# EAGLE board CHIP_POCKET_C (EAGLE 7.6.0)
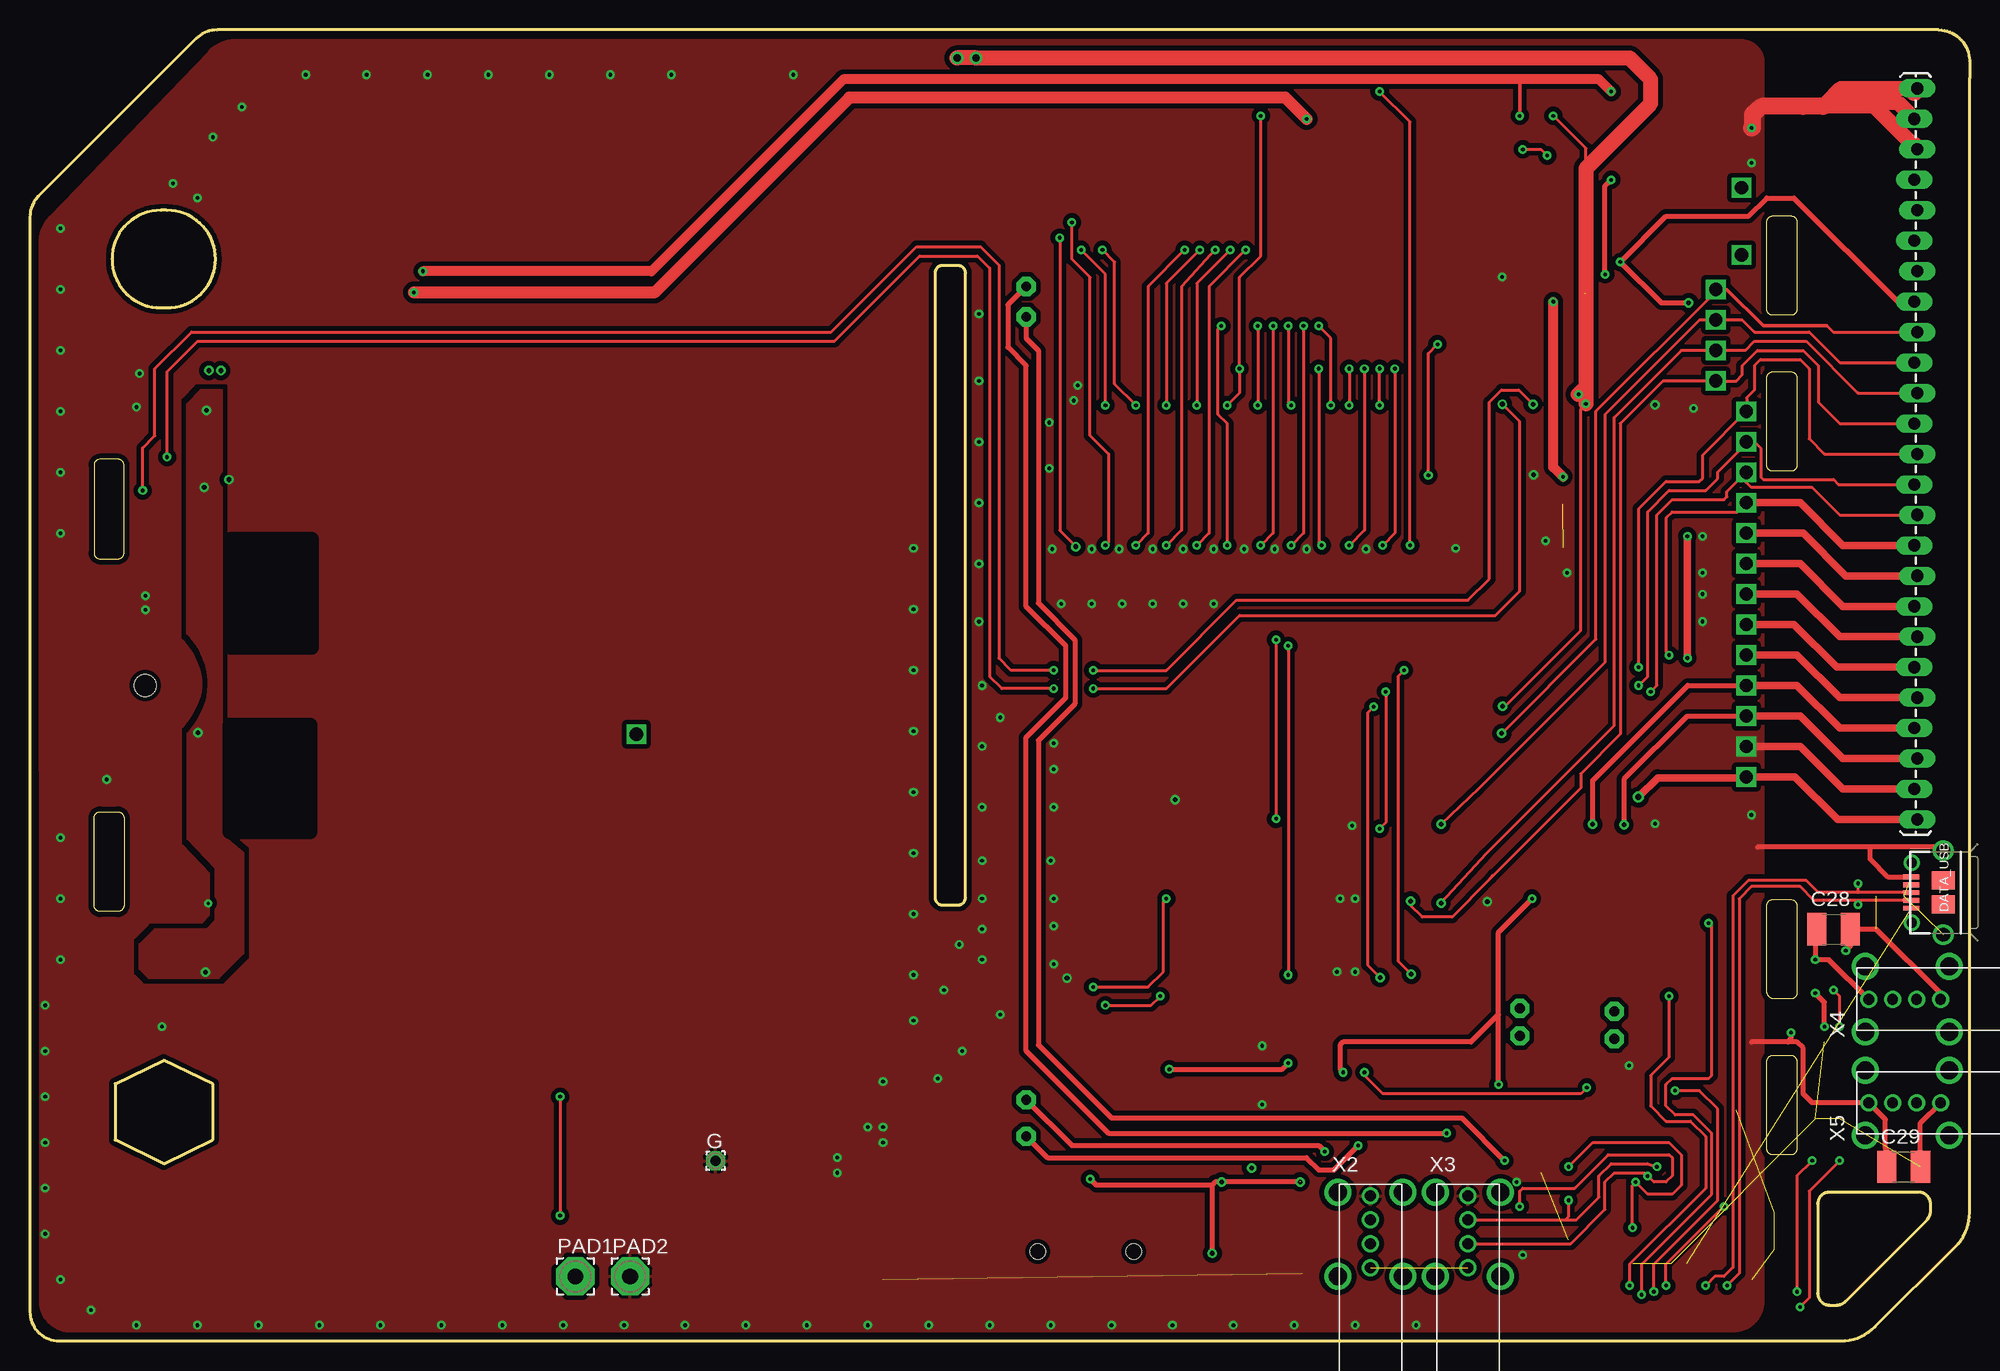
[diagram p2: board, top side]
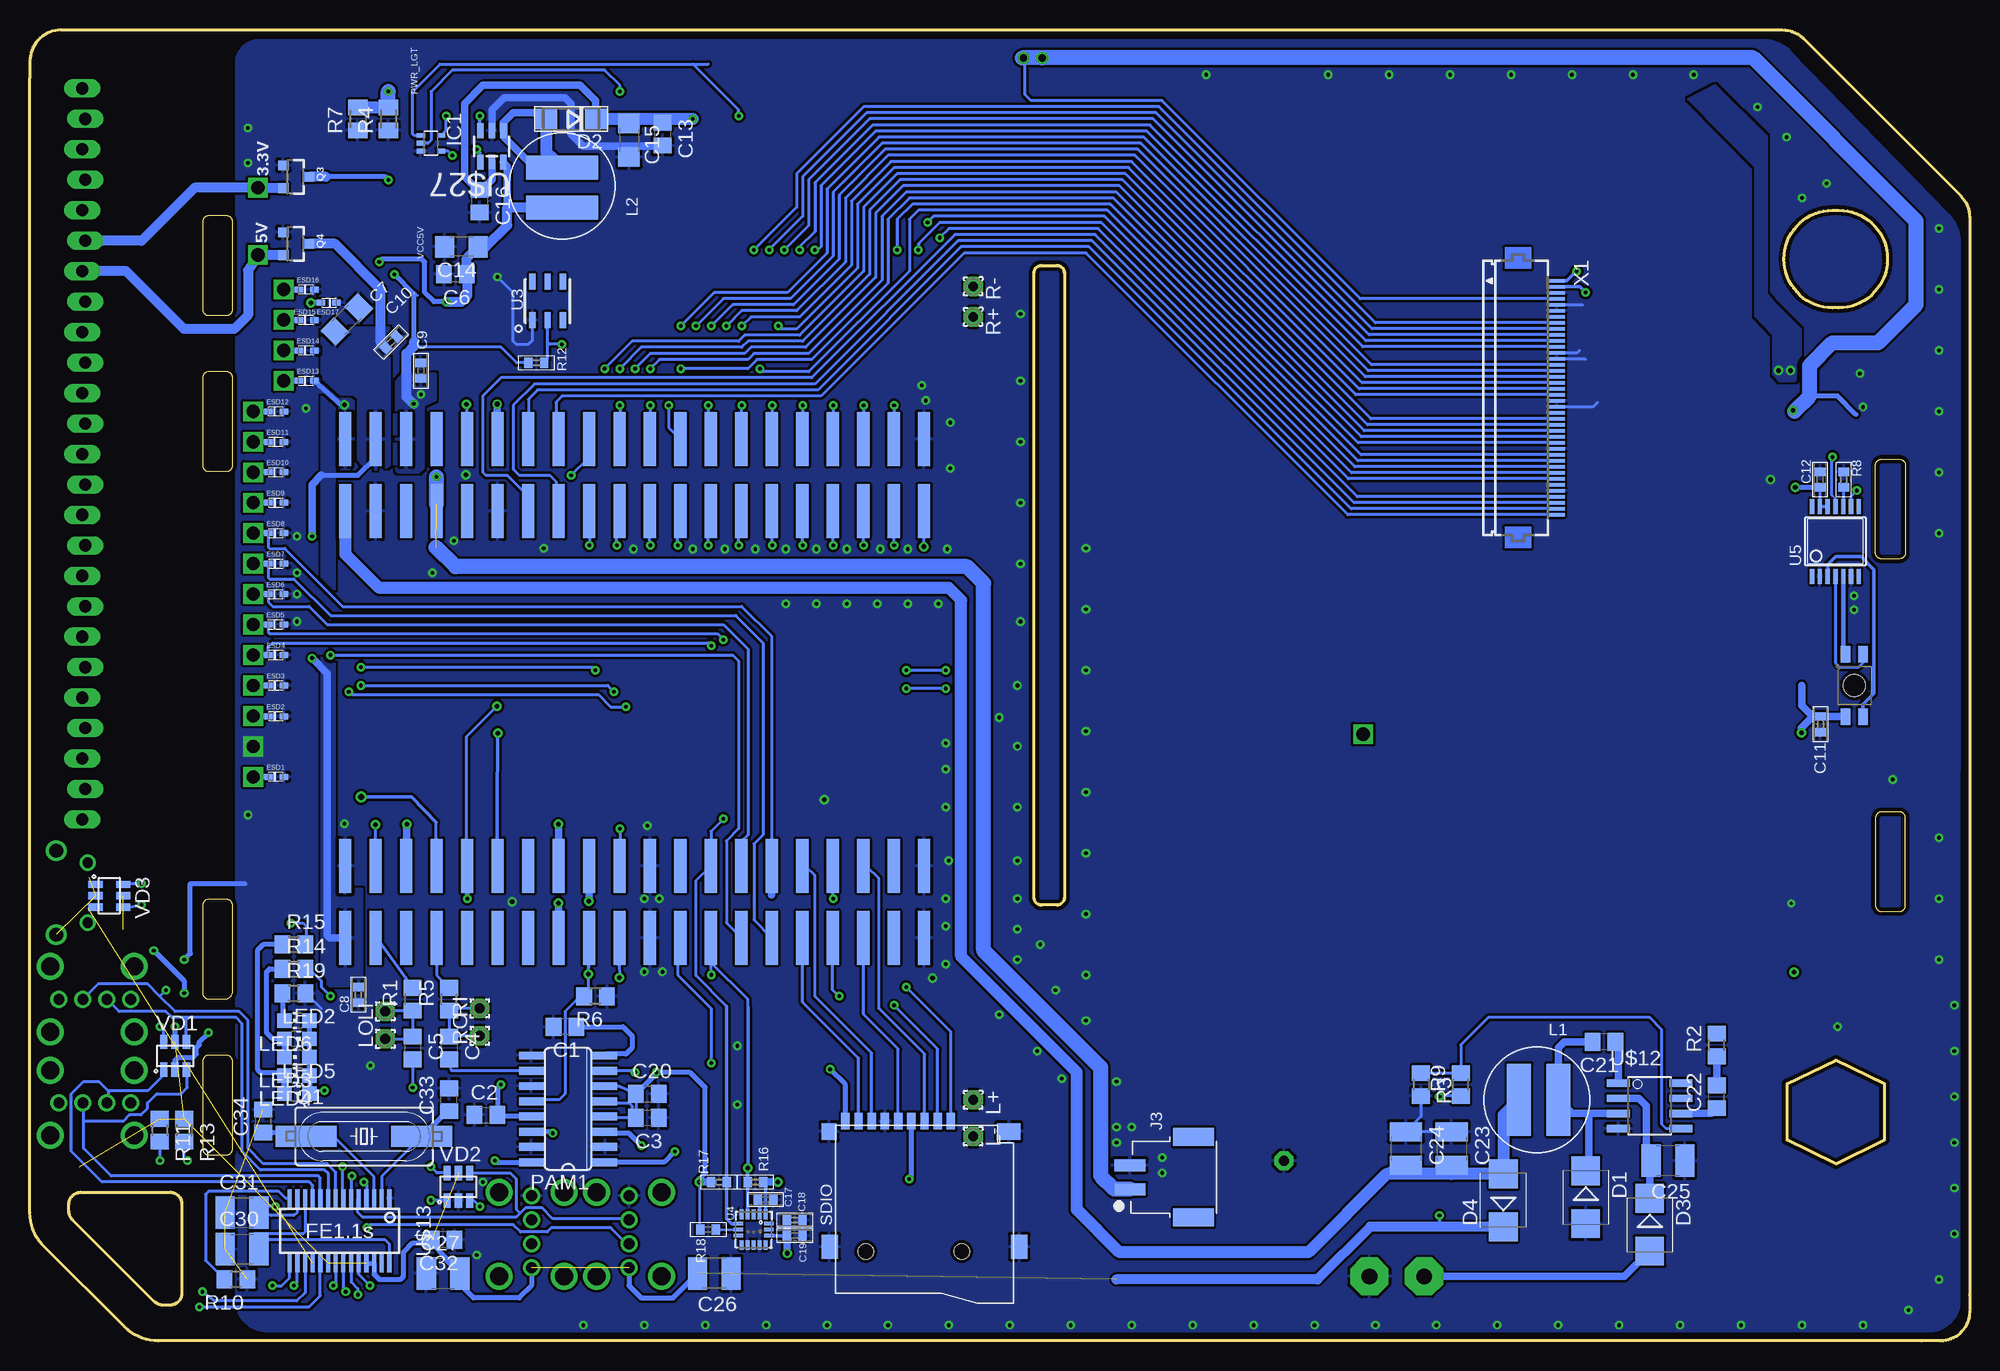
[diagram p3: board, bottom side, seen from below]

Size 161.7 x 109.31 mm. Coordinates in mm from the lower left corner, seen from the top.
Outline: 4,0 150.99,0 arc45 153.81,1.17 160.52,7.85 arc45 161.7,10.69 161.7,105.31
Outline: 0,3.85 0,93.72 arc-45 0.71,95.43 13.88,108.6 arc-45 15.59,109.31 159.13,109.31 arc-90 161.7,106.74 161.7,105.29
Outline: 0,3.84 0,2.42 arc90 2.42,0 4.02,0
Outline: 158.16,10.11 arc45 158.45,10.82 158.45,11.4 arc90 157.45,12.4 150.04,12.4 arc90 149.04,11.4 149.04,3.99 arc90 150.04,2.99 150.62,2.99 arc45 151.33,3.28 158.16,10.11
Outline: 11.41,86.15 arc90 15.48,90.21 arc90 11.41,94.27 10.9,94.27 arc90 6.84,90.21 arc90 10.9,86.15 11.41,86.15
Outline: 77.36,36.34 arc90 78,36.97 78,89.04 arc90 77.36,89.68 76.09,89.68 arc90 75.46,89.04 75.46,36.97 arc90 76.09,36.34 77.36,36.34
Outline: 7.09,21.44 7.09,16.75 11.16,14.78 15.22,16.75 15.22,21.44 11.16,23.41 7.09,21.44
Outline: 7.84,43.61 7.84,36.31 arc-90 7.34,35.81 5.84,35.81 arc-90 5.34,36.31 5.34,43.61 arc-90 5.84,44.11 7.34,44.11 arc-90 7.84,43.61
Outline: 5.34,73.01 5.34,65.71 arc90 5.84,65.21 7.34,65.21 arc90 7.84,65.71 7.84,73.01 arc90 7.34,73.51 5.84,73.51 arc90 5.34,73.01
Outline: 146.81,85.51 145.31,85.51 arc-90 144.81,86.01 144.81,93.31 arc-90 145.31,93.81 146.81,93.81 arc-90 147.31,93.31 147.31,86.01 arc-90 146.81,85.51
Outline: 146.81,72.51 145.31,72.51 arc-90 144.81,73.01 144.81,80.31 arc-90 145.31,80.81 146.81,80.81 arc-90 147.31,80.31 147.31,73.01 arc-90 146.81,72.51
Outline: 146.81,28.51 145.45,28.51 arc-90 144.81,29.15 144.81,36.31 arc-90 145.31,36.81 146.81,36.81 arc-90 147.31,36.31 147.31,29.01 arc-90 146.81,28.51
Outline: 146.81,15.51 145.31,15.51 arc-90 144.81,16.01 144.81,23.31 arc-90 145.31,23.81 146.81,23.81 arc-90 147.31,23.31 147.31,16.01 arc-90 146.81,15.51
Copper layers (1*2*15*16): Top 0.035mm / dielectric 0.2mm / Route2 0.035mm / dielectric 0.2mm / Route15 0.035mm / dielectric 0.2mm / Bottom 0.035mm
Design rules "Hampoo *": minimum track width 3mil, minimum drill 8mil, track to track 3mil, track to pad 3mil, pad to pad 3mil, via to via 3mil, smd to smd 3mil, copper to edge 12mil, drill to drill 8mil, minimum pad ring 10mil, minimum via ring 8mil, stop-mask expansion 4mil, vias tented up to drill 24mil, thermal gap 10mil
tRestrict: area 16.8,57.8 to 23.5,66.8; area 16.6,42.5 to 23.4,51.3

## Footprints (pad centres in the part's own frame; a part is rotated, then mirrored left to right if it is on the bottom)
C0805 = smd 1.3 x 1.5: 1 -0.95,0; 2 0.95,0
C1206 = smd 1.6 x 1.8: 1 -1.4,0; 2 1.4,0
C0402 = smd 0.7 x 0.9: 1 -0.65,0; 2 0.65,0
C1210 = smd 1.6 x 2.7: 1 -1.4,0; 2 1.4,0
SMB = smd 2.4 x 2.4: A 2.2,0; C -2.2,0
DO-214AC = smd 1.8 x 1.7: A 2.05,0; C -2.05,0
USB-MICROB-SMT-DIP = smd 0.4 x 1.35: D+ 0,2.675; D- -0.65,2.675; GND 1.3,2.675; ID 0.65,2.675; VBUS -1.3,2.675 | drill 1.15 pad 1.7: MT1 -3.5,0; MT2 3.5,0 | drill 0.85 pad 1.25: MT3 -2.5,2.625; MT4 2.5,2.625 | smd 1.5 x 1.9: P$1 -1,0; P$2 1,0.01
SOD523 = smd 0.7 x 0.5: A 0.7,0; C -0.6,0
1,6/0,8 = drill 0.813 pad 1.6 octagon: 1 0,0
SC70-5 = smd 0.4 x 0.7: 1 -0.65,-0.85; 2 0,-0.85; 3 0.65,-0.85; 4 0.65,0.85; 5 -0.65,0.85
2XAWHW40_G_SMD_R = smd 4.5 x 1.02 bottom: AP-EINT1 35.1,21.59; AP-EINT3 41.1,21.59; BAT 5.54,41.91; CHG-IN 5.54,49.53; CISD4 35.1,6.35; CSICK 41.1,16.51; CSID0 35.1,11.43; CSID1 41.1,11.43; CSID2 35.1,8.89; CSID3 41.1,8.89; CSID5 41.1,6.35; CSID6 35.1,3.81; CSID7 41.1,3.81; CSIHYSYNC 35.1,13.97; CSIVSYNC 41.1,13.97; CSPICK 35.1,16.51; FEL 35.1,41.91; GND@1 -0.46,49.53; GND@2 5.54,46.99; GND@3 5.54,36.83; GND@4 -0.46,1.27; GND@5 41.1,1.27; GND@6 35.1,1.27; GND@7 41.1,24.13; GND@8 35.1,24.13; GND@10 35.1,49.53; HPCOM 41.1,44.45; HPL 41.1,46.99; HPR 41.1,41.91; LCD-CLK -0.46,6.35; LCD-D2 -0.46,29.21; LCD-D3 5.54,26.67; LCD-D4 -0.46,26.67; LCD-D5 5.54,24.13; LCD-D6 -0.46,24.13; LCD-D7 5.54,21.59; LCD-D10 -0.46,21.59; LCD-D11 5.54,19.05; LCD-D12 -0.46,19.05; LCD-D13 5.54,16.51; LCD-D14 -0.46,16.51; LCD-D15 5.54,13.97; LCD-D18 -0.46,13.97; LCD-D19 5.54,11.43; LCD-D20 -0.46,11.43; LCD-D21 5.54,8.89; LCD-D22 -0.46,8.89; LCD-D23 5.54,6.35; LCD-DE 5.54,1.27; LCD-HSYNC 5.54,3.81; LCD-VSYNC -0.46,3.81; LRADC 35.1,36.83; MICIN1 41.1,36.83; MICM 41.1,39.37; PWM0 5.54,29.21; PWRON 5.54,39.37; TS 5.54,44.45; TWI1-SCK -0.46,36.83; TWI1-SDA -0.46,39.37; TWI2-SCK 41.1,19.05; TWI2-SDA 35.1,19.05; UART1-RX 35.1,44.45; UART1-TX 35.1,46.99; VCC1V8 -0.46,41.91; VCC3V3@1 35.1,39.37; VCC3V3@2 -0.46,44.45; VCC-5V@1 -0.46,46.99; VCC-5V@2 41.1,49.53; X1 -0.46,34.29; X2 5.54,34.29; XIO-P0 35.1,34.29; XIO-P1 41.1,34.29; XIO-P2 35.1,31.75; XIO-P3 41.1,31.75; XIO-P4 35.1,29.21; XIO-P5 41.1,29.21; XIO-P6 35.1,26.67; XIO-P7 41.1,26.67; Y1 -0.46,31.75; Y2 5.54,31.75
S2B-PH-SM4-TB = smd 2.6 x 1: 1 0,-1; 2 0,1 | smd 3.4 x 1.5: MNT1 5.3,3.35; MNT2 5.3,-3.35
1X20_LOCK_LONGPADS = drill 1.016 long: 1 0,0.127; 2 2.54,-0.127; 3 5.08,0.127; 4 7.62,-0.127; 5 10.16,0.127; 6 12.7,-0.127; 7 15.24,0.127; 8 17.78,-0.127; 9 20.32,0.127; 10 22.86,-0.127; 11 25.4,0.127; 12 27.94,-0.127; 13 30.48,0.127; 14 33.02,-0.127; 15 35.56,0.127; 16 38.1,-0.127; 17 40.64,0.127; 18 43.18,-0.127; 19 45.72,0.127; 20 48.26,-0.127; 21 50.8,0.127; 22 -2.54,-0.127; 23 -5.08,0.127; 24 -7.62,-0.127; 25 -10.16,0.127
SRN6045 = smd 2 x 6: P$1 1.5,0; P$2 -1.8,0
XZMDKCBDDG45S-9 = smd 1.4 x 0.8: BLUE -2.6,-0.725; GREEN 2.6,-0.725; RED 2.6,0.725; VIN -2.6,0.725 | hole 1.8: 0,0
CHIP-LED0805 = smd 1.2 x 1.2: A 0,-1.05; C 0,1.05
3,17/1,3 = drill 1.321 pad 3.175 octagon: 1 0,0
SOP-16 = smd 0.66 x 2.032: 1 -4.445,-3.073; 2 -3.175,-3.073; 3 -1.905,-3.073; 4 -0.635,-3.073; 5 0.635,-3.073; 6 1.905,-3.073; 7 3.175,-3.073; 8 4.445,-3.073; 9 4.445,3.073; 10 3.175,3.073; 11 1.905,3.073; 12 0.635,3.073; 13 -0.635,3.073; 14 -1.905,3.073; 15 -3.175,3.073; 16 -4.445,3.073
SM49 = smd 5.08 x 1.778: 1 -4.826,0; 2 4.826,0
SOT23-3 = smd 0.8 x 0.9: 1 -0.95,-1; 2 0.95,-1; 3 0,1.1
R0805 = smd 1.3 x 1.5: 1 -0.95,0; 2 0.95,0
M0805 = smd 1.3 x 1.6: 1 -0.95,0; 2 0.95,0
R0402 = smd 0.7 x 0.9: 1 -0.65,0; 2 0.65,0
TF-PULL = smd 0.7 x 1.4: 1 -2.2,-7.62; 2 -1.1,-7.62; 3 0,-7.62; 4 1.1,-7.62; 5 2.2,-7.62; 6 3.3,-7.62; 7 4.4,-7.62; 8 5.5,-7.62; 9 6.6,-7.62 | smd 1.4 x 2: S1 -7.9,2.85; S2 7.9,2.85 | smd 1.28 x 1.4: S3 7.96,-6.75 | smd 1.95 x 1.4: S4 -7.025,-6.75 | hole 1.25: -3.1,3.25; 4.9,3.25
TSOC6 = smd 0.53 x 1.33: 1 -1.27,-1.6; 2 0,-1.6; 3 1.27,-1.6; 4 1.27,1.6; 5 0,1.6; 6 -1.27,1.6
QFN-16_0.5MM = smd 0.8 x 0.3: 1 -1.275,1; 2 -1.275,0.5; 3 -1.275,0; 4 -1.275,-0.5; 5 -1.275,-1; 9 1.275,-1; 10 1.275,-0.5; 11 1.275,0; 12 1.275,0.5; 13 1.275,1 | smd 0.3 x 0.8: 6 -0.5,-1.275; 7 0,-1.275; 8 0.5,-1.275; 14 0.5,1.275; 15 0,1.275; 16 -0.5,1.275
TSSOP14 = smd 0.36 x 1.26: 1 -1.95,-2.918; 2 -1.3,-2.918; 3 -0.65,-2.918; 4 0,-2.918; 5 0.65,-2.918; 6 1.3,-2.918; 7 1.95,-2.918; 8 1.95,2.918; 9 1.3,2.918; 10 0.65,2.918; 11 0,2.918; 12 -0.65,2.918; 13 -1.3,2.918; 14 -1.95,2.918
SOP-8 = smd 1.905 x 0.61: 1 -2.616,1.905; 2 -2.616,0.635; 3 -2.616,-0.635; 4 -2.616,-1.905; 5 2.616,-1.905; 6 2.616,-0.635; 7 2.616,0.635; 8 2.616,1.905
FE1.1S_SSOP-28 = smd 0.35 x 1.5: 1 -4.16,-2.7; 2 -3.52,-2.7; 3 -2.88,-2.7; 4 -2.24,-2.7; 5 -1.6,-2.7; 6 -0.96,-2.7; 7 -0.32,-2.7; 8 0.32,-2.7; 9 0.96,-2.7; 10 1.6,-2.7; 11 2.24,-2.7; 12 2.88,-2.7; 13 3.52,-2.7; 14 4.16,-2.7; 15 4.16,2.7; 16 3.52,2.7; 17 2.88,2.7; 18 2.24,2.7; 19 1.6,2.7; 20 0.96,2.7; 21 0.32,2.7; 22 -0.3,2.7; 23 -0.96,2.7; 24 -1.6,2.7; 25 -2.24,2.7; 26 -2.88,2.7; 27 -3.52,2.7; 28 -4.16,2.7
SOT23-6 = smd 0.559 x 1.219: 1 -0.95,-1.3; 2 0,-1.3; 3 0.965,-1.3; 4 0.965,1.321; 5 0,1.3; 6 -0.95,1.321
SOT-23-6L = smd 0.6 x 1.2: 1 -0.95,-2.3; 2 0,-2.3; 3 0.95,-2.3; 4 0.95,0; 5 0,0; 6 -0.95,0
FH12-40S-0.5SH = smd 0.3 x 1.3: 1 -9.75,3.25; 2 -9.25,3.25; 3 -8.75,3.25; 4 -8.25,3.25; 5 -7.75,3.25; 6 -7.25,3.25; 7 -6.75,3.25; 8 -6.25,3.25; 9 -5.75,3.25; 10 -5.25,3.25; 11 -4.75,3.25; 12 -4.25,3.25; 13 -3.75,3.25; 14 -3.25,3.25; 15 -2.75,3.25; 16 -2.25,3.25; 17 -1.75,3.25; 18 -1.25,3.25; 19 -0.75,3.25; 20 -0.25,3.25; 21 0.25,3.25; 22 0.75,3.25; 23 1.25,3.25; 24 1.75,3.25; 25 2.25,3.25; 26 2.75,3.25; 27 3.25,3.25; 28 3.75,3.25; 29 4.25,3.25; 30 4.75,3.25; 31 5.25,3.25; 32 5.75,3.25; 33 6.25,3.25; 34 6.75,3.25; 35 7.25,3.25; 36 7.75,3.25; 37 8.25,3.25; 38 8.75,3.25; 39 9.25,3.25; 40 9.75,3.25
USB-A-HU = drill 0.9: D+ 4.73,0; D- 2.73,0; GND 6.73,0; VBUS 0.73,0 | drill 1.5: P$5 0,2.72; P$6 0,-2.72; P$7 7,2.72; P$8 7,-2.72

## Placement (x,y rotation side)
C1  100nF  [C0805]  117.09,26.2 180 bottom
C2  1uF  [C0805]  123.7,18.84 0 bottom
C3  1uF  [C0805]  110.24,18.58 180 bottom
C4  470nF  [C0805]  126.75,24.42 270 bottom
C5  470nF  [C0805]  129.79,24.42 270 bottom
C6  100nF  [C0805]  126.24,88.94 180 bottom
C7  22uF  [C1206]  135.29,85.17 45 bottom
C8  100nF  [C0402]  134.31,28.86 270 bottom
C9  100nF  [C0402]  129.12,80.89 90 bottom
C10  100nF  [C0402]  131.58,83.28 45 bottom
C11  1uF  [C0402]  12.42,51.41 90 bottom
C12  1uF  [C0402]  12.45,71.82 270 bottom
C13  100nF  [C0805]  108.97,100.62 270 bottom
C14  22uF  [C1206]  125.73,91.23 180 bottom
C15  22uF  [C1206]  111.76,100.12 270 bottom
C16  10nF  [C0805]  124.21,95.04 270 bottom
C17  100nF  [C0402]  100.38,11.78 0 bottom
C18  4.7uF  [C0402]  97.94,10.07 0 bottom
C19  100nF  [C0402]  97.94,8.78 0 bottom
C20  1uF  [C0805]  110.24,20.61 0 bottom
C21  10nF/50V  [C0805]  30.48,24.93 180 bottom
C22  2.2nF  [C0805]  21.08,20.36 90 bottom
C23  VJ1210V106ZXJTW1BC  [C1210]  43.18,16.04 270 bottom
C24  VJ1210V106ZXJTW1BC  [C1210]  46.99,16.04 270 bottom
C25  10uF/25V  [C1210]  25.15,15.03 180 bottom
C26  n.a.  [C1210]  104.65,5.63 180 bottom
C27  n.a.  [C1210]  127.25,5.63 0 bottom
C28  n.a.  [C1210]  150.37,34.33 0 top
C29  n.a.  [C1210]  156.21,14.52 0 top
C30  VJ1210V106ZXJTW1BC  [C1210]  144.02,7.66 0 bottom
C31  VJ1210V106ZXJTW1BC  [C1210]  144.02,10.71 0 bottom
C32  100nF  [C0805]  127.25,8.42 180 bottom
C33  22pF  [C0805]  126.75,20.11 90 bottom
C34  22pF  [C0805]  142.24,18.33 90 bottom
D1  ES2D  [SMB]  32,11.98 270 bottom
D2  B240A  [DO-214AC]  116.59,101.89 180 bottom
D3  ES2D  [SMB]  26.67,9.69 270 bottom
D4  ES2D  [SMB]  38.86,11.72 90 bottom
DATA_USB  USBUSB-MICROB-SMT-DIP  [USB-MICROB-SMT-DIP]  159.51,37.38 90 top
ESD1  ESD5Z2.5T1G  [SOD523]  141.22,47.03 0 bottom
ESD2  ESD5Z2.5T1G  [SOD523]  141.22,52.08 0 bottom
ESD3  ESD5Z2.5T1G  [SOD523]  141.22,54.65 0 bottom
ESD4  ESD5Z2.5T1G  [SOD523]  141.22,57.2 0 bottom
ESD5  ESD5Z2.5T1G  [SOD523]  141.23,59.74 0 bottom
ESD6  ESD5Z2.5T1G  [SOD523]  141.23,62.27 0 bottom
ESD7  ESD5Z2.5T1G  [SOD523]  141.22,64.81 0 bottom
ESD8  ESD5Z2.5T1G  [SOD523]  141.22,67.35 0 bottom
ESD9  ESD5Z2.5T1G  [SOD523]  141.22,69.89 0 bottom
ESD10  ESD5Z2.5T1G  [SOD523]  141.23,72.44 0 bottom
ESD11  ESD5Z2.5T1G  [SOD523]  141.23,74.96 0 bottom
ESD12  ESD5Z2.5T1G  [SOD523]  141.23,77.51 0 bottom
ESD13  ESD5Z2.5T1G  [SOD523]  138.69,80.05 0 bottom
ESD14  ESD5Z2.5T1G  [SOD523]  138.69,82.58 0 bottom
ESD15  ESD5Z2.5T1G  [SOD523]  138.69,85.12 0 bottom
ESD16  ESD5Z2.5T1G  [SOD523]  138.69,87.67 0 bottom
ESD17  ESD5Z2.5T1G  [SOD523]  136.76,86.57 180 bottom
G  [1,6/0,8]  57.15,15.03 0 top
IC1  74AHC1G08DCK  [SC70-5]  128.27,99.86 270 bottom
J1  2X20-CHIP2X20-SMT-CHIP  [2XAWHW40_G_SMD_R]  85.88,74.72 270 top
J3  S2B-PH-SM4-TB  [S2B-PH-SM4-TB]  70,13.65 0 bottom
JP1  NC  [1X20_LOCK_LONGPADS]  157.21,94.27 270 top
L1  SRN6045-100M  [SRN6045]  36.07,20.11 180 bottom
L2  SRN6045-100M  [SRN6045]  117.35,96.31 90 bottom
L+  [1,6/0,8]  83.06,20.11 270 bottom
L-  [1,6/0,8]  83.06,17.06 270 bottom
LED1  XZMDKCBDDG45S-9  [XZMDKCBDDG45S-9]  9.6,54.65 90 bottom
LED2  150080BS75000  [CHIP-LED0805]  139.45,25.19 270 bottom
LED3  150080BS75000  [CHIP-LED0805]  139.45,23.66 90 bottom
LED4  150080BS75000  [CHIP-LED0805]  139.45,22.14 90 bottom
LED5  150080BS75000  [CHIP-LED0805]  139.45,20.61 270 bottom
LED6  150080BS75000  [CHIP-LED0805]  139.45,26.71 90 bottom
LI  [1,6/0,8]  132.08,27.47 90 bottom
LO  [1,6/0,8]  132.08,25.19 90 bottom
PAD1  WIREPAD3,17/1,3  [3,17/1,3]  45.47,5.37 0 top
PAD2  WIREPAD3,17/1,3  [3,17/1,3]  50.04,5.37 0 top
PAM1  [SOP-16]  116.84,19.34 90 bottom
Q1  FOXSDLF/120-20  [SM49]  133.86,17.06 0 bottom
Q3  MOSFET-PCHANNEL  [SOT23-3]  139.57,97.07 270 bottom
Q4  MOSFET-PCHANNEL  [SOT23-3]  139.57,91.48 270 bottom
R1  10k  [R0805]  129.79,28.49 90 bottom
R2  15k  [R0805]  21.08,24.68 90 bottom
R3  10k  [R0805]  45.72,21.38 270 bottom
R4  10 / n.a.  [M0805]  131.83,101.89 90 bottom
R5  10k  [R0805]  126.75,28.49 90 bottom
R6  12k  [R0805]  114.55,28.74 180 bottom
R7  10 / n.a.  [M0805]  134.37,101.89 90 bottom
R8  62K  [R0402]  10.49,71.82 270 bottom
R9  28.7k  [R0805]  42.42,21.38 90 bottom
R10  2.7k  [R0805]  144.53,5.12 180 bottom
R11  10k  [R0805]  150.88,17.57 270 bottom
R12  4.7K  [R0402]  119.49,81.56 180 bottom
R13  10k  [R0805]  148.84,17.57 270 bottom
R14  ERJ-6ENF3300V  [R0805]  139.7,31.03 0 bottom
R15  ERJ-6ENF3300V  [R0805]  139.7,33.06 0 bottom
R16  4.7K  [R0402]  101.22,13.25 0 bottom
R17  4.7K  [R0402]  104.27,13.25 180 bottom
R18  4.7K  [R0402]  105.16,9.29 180 bottom
R19  ERJ-6ENF3300V  [R0805]  139.7,29 0 bottom
R+  [1,6/0,8]  83.06,85.38 270 bottom
R-  [1,6/0,8]  83.06,87.92 270 bottom
RI  [1,6/0,8]  124.21,27.73 90 bottom
RO  [1,6/0,8]  124.21,25.44 90 bottom
SDIO  TF-HOLDER  [TF-PULL]  87.12,10.71 180 bottom
U3  DS2431P  [TSOC6]  118.55,86.71 0 bottom
U4  MMA8452Q  [QFN-16_0.5MM]  101.37,9.29 270 bottom
U5  NCP5623DTBR2G  [TSSOP14]  11.18,66.66 0 bottom
U$12  ACT4060ASHDEFAULT  [SOP-8]  26.67,19.6 0 bottom
U$13  FE1.1S  [FE1.1S_SSOP-28]  135.89,9.18 180 bottom
U$27  AP3032 / n.a.  [SOT23-6]  123.19,99.61 180 bottom
VD1  n.a.  [SOT-23-6L]  149.61,24.93 0 bottom
VD2  n.a.  [SOT-23-6L]  125.98,14.01 0 bottom
VD3  n.a.  [SOT-23-6L]  153.92,37.12 270 bottom
X1  FH12-40S-0.5SH  [FH12-40S-0.5SH]  37.64,78.64 270 bottom
X2  USB-A-HU  [USB-A-HU]  111.76,5.37 90 top
X3  USB-A-HU  [USB-A-HU]  119.89,5.37 90 top
X4  USB-A-HU  [USB-A-HU]  160.02,28.49 180 top
X5  USB-A-HU  [USB-A-HU]  160.02,19.85 180 top

## Tracks (layer width: path | path; a pad name or v marks a point on that pad's centre or on a via)
1WIRE  (via drill 0.3)
  Top 0.254: v116.59,72.18 116.59,82.34 v117.35,83.1
  Bottom 0.254: J1.LCD-D2 115.14,75.22 115.14,73.62 v116.59,72.18 | v117.35,83.1 118.36,83.1 118.55,83.28 | 118.55,83.28 118.55,83.61 U3.2 | R12.1 118.55,81.85 118.55,83.28
3V3_SAFE  (via drill 1.1)
  Bottom 0.813: Q3.2 142.67,96.12 v142.7,96.15 147.98,96.15 152.4,91.73 155.7,91.73 156.21,91.73 JP1.2
5V_SAFE  (via drill 1.1)
  Bottom 0.61: 142.66,90.51 v142.7,90.55
  Bottom 0.813: Q4.2 142.68,90.53 v142.7,90.55 | 142.66,90.51 143.51,89.27 143.51,85.54 144.68,84.37 148.84,84.37 153.67,89.19 JP1.3
ADC  (via drill 0.38, 1.1)
  Top 0.254: v122.7,50.66 130.56,58.52 130.56,77.51 140.56,87.51 v140.56,87.67 | 149.8,84.65 150.34,84.11 JP1.5
  Top 0.305: 149.8,84.65 144.5,84.65 141.48,87.67 v140.56,87.67
  Bottom 0.305: 122.76,43.61 122.75,44.24 | 122.75,44.24 v122.7,50.66 | J1.LRADC 122.75,39.66 122.75,44.24
  Bottom 0.406: ESD16.C 139.23,87.67 v140.56,87.67
AUDIO_L
  Bottom 0.254: R1.2 132.59,33.33 J1.HPL
AUDIO_R
  Bottom 0.254: J1.HPR 127.79,30.49 R5.2
CHR
  Bottom 0.61: 46.99,14.52 48.01,14.52 48.77,13.76
  Bottom 0.813: C23.2 43.18,13.92 | C24.2 46.99,14.52
  Bottom 1.016: L1.P$1 38.86,18.81 D4.A 43.18,13.92 48.6,13.92 48.77,13.76 55.12,7.41 70.87,7.41 74.42,10.96 74.42,22.39 84.07,32.04 84.07,61.76 85.09,62.78 132.59,62.78 135.38,65.57 135.38,69.14 J1.CHG-IN
DCLK  (via drill 0.3)
  Top 0.254: v92.2,78.02 90.42,79.8 90.42,89.96 v89.41,90.97
  Bottom 0.254: X1.30 50.74,73.89 71.63,94.78 88.14,94.78 89.41,93.51 v89.41,90.97 | v92.2,78.02 92.2,75.21 J1.LCD-CLK
DISPL_GND  (via drill 0.3)
  Top 0.305: v124.21,102.15 124.21,105.2
  Top 0.813: v131.83,104.18 130.81,105.2 124.21,105.2 67.82,105.2 51.82,89.19 v32.77,89.19
  Bottom 0.305: v32.77,89.19 33.57,88.39 X1.1 | U$27.3 124.21,100.96 v124.21,102.15
  Bottom 1.016: R4.2 R7.2
  Bottom 1.27: R4.2 v131.83,104.18
DM1
  Bottom 0.254: U$13.10 137.49,13.58 137.67,13.76 154.94,13.76 157.23,16.04 157.23,18.33 | 157.23,18.33 157.23,19.79 X5.D- | 157.23,18.33 153.92,18.33 153.42,18.84 152.45,18.84 151.89,19.4 151.89,19.85 151.13,20.61 149.1,20.61 148.59,21.12 148.59,22.57 VD1.3
DM2  (via drill 0.3)
  Top 0.254: v150.88,26.2 150.88,28.74 v150.37,29.25
  Bottom 0.254: U$13.8 136.21,14.08 136.91,14.77 142.24,14.77 143.51,16.04 143.51,26.71 144.27,27.47 149.61,27.47 150.88,28.74 | 150.88,28.74 151.89,29.76 156.02,29.76 X4.D- | VD1.6 150.56,25.88 v150.88,26.2 | v150.37,29.25 150.88,28.74
DM3  (via drill 0.3)
  Top 0.254: X3.D- 128.46,8.1 131.32,10.96 131.32,13.25 132.08,14.01 134.62,14.01 v134.87,13.76 135.38,13.25 136.4,13.25 136.91,13.76 136.91,15.28 136.65,15.53 131.57,15.53 128.78,12.74 124.46,12.74 124.21,12.49 v124.21,11.22
  Bottom 0.254: v134.87,13.76 134.93,13.7 U$13.6 | VD2.3 124.7,11.71 v124.21,11.22
DM4  (via drill 0.3)
  Top 0.254: v133.6,9.44 133.6,12.99 v133.86,13.25 134.87,12.23 136.91,12.23 137.67,12.99 137.67,15.53 136.65,16.55 130.3,16.55 v128.27,14.52
  Bottom 0.254: X2.D- 111.95,8.1 113.28,9.44 118.24,9.44 118.59,9.09 120.81,9.09 121.41,9.69 133.35,9.69 v133.6,9.44 | v133.86,13.25 133.65,13.04 U$13.4 | VD2.6 127.76,14.01 v128.27,14.52
DMU  (via drill 0.3)
  Top 0.254: DATA_USB.D- 152.4,36.73 | 152.4,36.73 148.73,36.73 147.57,37.89 143.51,37.89 142.49,36.87 142.49,5.63 v141.48,4.61 | v152.4,36.36 152.4,36.73
  Bottom 0.254: v141.48,4.61 140.72,4.61 140.05,5.28 U$13.15 | VD3.4 153.86,36.11 v152.4,36.36
DP1
  Bottom 0.254: U$13.11 138.13,12.95 138.43,13.25 155.7,13.25 158.24,15.79 158.24,20.61 157.23,21.63 155.96,21.63 155.19,20.87 | 155.19,20.87 155.19,19.95 X5.D+ | VD1.1 150.56,22.2 151.89,20.87 155.19,20.87
DP2
  Bottom 0.254: U$13.9 136.85,13.95 137.16,14.26 142.49,14.26 144.02,15.79 144.02,26.46 144.53,26.96 148.59,26.96 | 148.59,26.96 149.86,26.96 150.37,27.47 154.27,27.47 X4.D+ | VD1.4 148.66,26.9 148.59,26.96
DP3  (via drill 0.3)
  Top 0.254: X3.D+ 128.02,10.1 | 128.02,10.1 128.94,10.1 130.81,11.98 130.81,13.76 131.83,14.77 134.87,14.77 v135.64,14.52 | v128.27,11.72 128.27,10.36 128.02,10.1
  Bottom 0.254: U$13.7 135.64,11.95 v135.64,14.52 | VD2.1 128.26,11.71 v128.27,11.72
DP4
  Bottom 0.254: X2.D+ 111.86,10.2 118.11,10.2 119,11.09 120.4,11.09 120.84,10.64 | 120.84,10.64 121.16,10.33 133.99,10.33 134.37,10.71 134.37,11.81 U$13.5 | VD2.4 121.67,14.01 121.16,13.5 121.16,10.96 120.84,10.64
DPU  (via drill 0.3)
  Top 0.254: DATA_USB.D+ 152.4,37.38 | 152.4,37.38 149.1,37.38 148.08,38.39 143.26,38.39 141.99,37.12 141.99,6.14 141.22,5.37 140.46,5.37 v139.7,4.61 | v152.4,38.14 152.4,37.38
  Bottom 0.254: v139.7,4.61 139.41,4.9 U$13.16 | VD3.6 153.86,38.14 v152.4,38.14
EN  (via drill 0.3)
  Top 0.254: v99.82,78.02 100.84,79.03 v100.84,81.07 100.84,88.69 102.62,90.46 v102.62,102.15
  Bottom 0.254: X1.31 51,73.39 71.88,94.27 87.63,94.27 88.39,93.51 88.39,89.19 96.77,80.81 100.58,80.81 v100.84,81.07 | v99.82,78.02 99.82,75.21 | 99.82,75.21 99.82,74.72 | IC1.1 129.68,100.51 129.79,100.62 129.79,104.18 127.51,106.47 106.43,106.47 | 106.43,106.47 105.16,106.47 | J1.LCD-D18 99.82,75.21 | v102.62,102.15 102.62,102.66 106.43,106.47
FB  (via drill 0.3)
  Top 1.016: v106.43,101.89 104.65,103.67 68.33,103.67 52.07,87.42 v32,87.42
  Bottom 0.305: v32,87.42 32.48,87.89 X1.2
  Bottom 0.61: C15.1 111.76,101.89 | C13.1 108.97,101.89 | D2.C 114.54,103.4 115.82,104.69 123.95,104.69 125.48,103.16 125.48,97.07 124.71,96.31 124.46,96.31 | 124.46,96.31 123.7,96.31 123.19,96.81 U$27.5 | C16.1 124.21,96.05 124.46,96.31
  Bottom 1.016: D2.C 111.76,101.89 108.97,101.89 v106.43,101.89
FEL  (via drill 0.5, 1.1)
  Top 0.61: v134.1,45.35 135.7,46.95 143.07,46.95 v143.1,47.03 147,47.04 147.14,47.04 150.7,43.47 JP1.21
  Bottom 0.254: 143.05,47.03 v143.1,47.03 | J1.FEL 127.84,39.66 127.84,43.24
  Bottom 0.305: 127.84,43.24 129.9,45.35 v134.1,45.35
  Bottom 0.406: ESD1.C 143.07,47.01 v143.1,47.03
GND  (via drill 0.25, 0.3, 0.3 pad 0.56, 0.38, 1.1)  (5 unrouted)
  Top 0.406: DATA_USB.MT2 159.2,41.19 153.42,41.19 | 153.42,41.19 144.02,41.19 | DATA_USB.GND 156.81,38.65 154.94,38.65 153.42,40.17 153.42,41.19 | C28.1 148.84,34.21 v148.84,31.79 149.99,31.79 X4.GND | 146.56,24.93 147.32,24.93 147.83,24.42 147.83,20.61 148.59,19.85 X5.GND 154.69,18.46 154.69,16.04 154.81,15.92 C29.1 | 146.56,24.93 143.51,24.93 | v146.81,25.69 146.81,25.19 146.56,24.93
  Top 0.61: v143.1,49.57 147.57,49.57 151.13,46.01 JP1.20
  Top 1.27: 149.5,102.95 149.79,103.24 | 149.79,103.24 150.98,104.43 JP1.25 | 157.09,99.61 153.75,102.95 147.83,102.95 | JP1.24 155.74,103.24 149.79,103.24
  Top 1.422: 149.5,102.95 147.83,102.95 144.4,102.95 143.6,102.25 143.6,101.2 v143.54,101.13
  Top 1.524: JP1.25 157.09,104.18 | 157.09,99.61 arc90 JP1.23
  Bottom 0.254: X1.5 32.27,86.39 32.26,86.4 | v122.72,88.71 121.41,87.4 121.41,83.35 121.16,83.1 120.14,83.1 119.82,83.42 U3.1 | X1.22 31.37,77.89 30.99,78.27 | X1.14 32.07,81.89 32,81.83 | X1.13 32.71,82.39 32.51,82.59 | J1.GND@3 122.43,68.89 122.43,68.87 122.83,68.48 | R3.2 45.72,18.71 C24.1 | C23.1 C24.1 | C24.1 47.12,17.44 47.5,17.82 47.37,17.82 C24.1 | R19.2 138.68,29 137.41,27.73
  Bottom 0.406: ESD13.A 135.73,78.04 v135.5,78.04 | v148.84,31.79 148.34,32.3 148.34,38.14 143.76,38.14 | VD1.2 149.61,23.41 149.35,23.66 148.08,23.66 147.83,23.92 147.83,24.42 147.57,24.68 147.57,24.93 v146.81,25.69
  Bottom 0.61: U$27.2 123.19,102.66 122.17,103.67 117.09,103.67 116.59,103.16 116.59,100.62 115.57,99.61 111.76,99.61 | 111.76,99.61 109.03,99.61 C13.2 | C15.2 111.76,99.61
  other vias: 135.48,43.12 6.4,46.81 2.54,36.87 11.02,26.2 1.27,12.74 125.37,72.23 95.47,45.13 86.45,30.27 84.96,76.58 87.34,79.67 87.03,78.41 121.51,36.62 14.85,36.49 17.67,102.89 9.14,80.66 8.89,77.87 11.93,96.51 16.6,71.82 9.63,62.14 9.63,60.98 110.24,42.97 115.57,1.31 110.49,1.31 105.41,1.31 100.33,1.31 95.25,1.31 90.17,1.31 85.09,1.31 80.01,1.31 63.63,105.58 53.47,105.58 48.39,105.58 43.31,105.58 38.23,105.58 33.15,105.58 28.07,105.58 22.99,105.58 15.24,100.37 13.97,95.29 2.54,92.75 2.54,87.67 2.54,82.59 2.54,77.51 2.54,72.43 2.54,67.35 2.54,41.95 2.54,31.79 1.27,27.98 1.27,24.17 1.27,20.36 1.27,16.55 1.27,8.93 2.54,5.12 5.08,2.58 8.89,1.31 13.97,1.31 19.05,1.31 24.13,1.31 29.21,1.31 34.29,1.31 39.37,1.31 44.45,1.31 49.53,1.31 54.61,1.31 59.69,1.31 64.77,1.31 69.85,1.31 74.93,1.31 73.66,66.08 73.66,61 73.66,55.92 73.66,50.84 73.66,45.76 73.66,40.68 73.66,35.6 73.66,30.52 77.47,33.06 75.69,21.88 77.72,24.17 73.66,26.71 76.2,29.25 71.12,21.63 71.12,17.82 69.85,17.82 67.31,15.28 67.31,14.01 71.12,16.55 85.98,61.46 85.22,66.03 88.52,66.03 88.52,61.46 91.06,61.46 90.81,66.03 93.6,66.03 93.6,61.46 96.14,61.46 96.14,66.03 98.68,66.03 98.68,61.46 101.22,66.03 103.76,66.03 106.43,66.03 111.38,66.03 80.9,51.98 85.34,49.82 85.34,47.67 85.34,44.49 79.38,54.65 79.38,44.49 85.09,40.05 85.34,36.87 85.34,34.58 85.34,31.41 79.38,40.05 79.38,36.87 79.38,34.33 79.38,31.79 80.9,27.22 143.54,98.22 143.51,43.86 123.95,13.25 118.87,66.08 128.14,64.05 126.36,66.72 110.49,30.77 108.97,30.77 109.22,36.87 110.49,36.87 84.96,72.77 102.74,19.7 102.74,24.6 79.38,49.57 79.12,59.98 79.12,64.81 79.12,69.89 79.12,74.97 79.12,80.05 79.12,85.64 139.45,59.98 139.45,62.27 139.45,64.05 139.45,67.1 138.68,77.76 133.32,22.95 124.46,7.15
  pour Bottom (isolate 0.203, rank 4): 142.33,108.46 17.12,108.46 arc45 14.92,107.5 1.74,93.91 arc44 0.81,91.52 0.85,3.44 arc90 3.25,0.8 141.83,0.8 arc90 144.53,3.34 144.53,106.72 arc90
  pour Top (isolate 0.4, rank 3): 79.63,0.8 79.63,108.46 17.07,108.46 arc45 14.92,107.5 1.69,93.75 arc44 0.8,91.56 0.85,3.44 arc90 3.25,0.8
  pour Top (isolate 0.4, rank 3): 144.53,3.34 144.53,106.72 arc90 142.49,108.46 79.63,108.46 79.63,0.8 141.99,0.8 arc90
GP1  (via drill 0.38, 1.1)
  Top 0.254: v117.64,43.07 120.8,46.07 131.32,56.58 131.32,77.26 139.19,85.13 v140.56,85.13 142.75,85.13 143.76,84.11 148.34,84.11 150.88,81.57 JP1.6
  Bottom 0.254: J1.XIO-P2 117.64,40.05
  Bottom 0.406: ESD15.C 139.3,85.13 v140.56,85.13
  Bottom 0.61: v117.64,43.07 117.64,40.05
GP2  (via drill 0.38, 1.1)
  Top 0.254: v117.64,36.51 121.41,40.63 132.08,51.3 132.08,77 137.67,82.59 v140.56,82.59 143,82.59 143.76,83.35 148.08,83.35 152.4,79.03 JP1.7
  Bottom 0.254: J1.XIO-P3 117.6,33.58 117.6,33.57 J1.XIO-P3 117.64,34.05
  Bottom 0.406: ESD14.C v140.56,82.59
  Bottom 0.61: v117.64,36.51 117.64,34.05
GP3  (via drill 0.38, 1.1)
  Top 0.254: 122.02,38.85 121.75,38.57 121.11,37.93 | 121.11,37.93 119.02,35.8 118.57,35.35 116.08,35.35 115.11,36.32 v115.11,36.67 | 121.11,37.93 129.29,46.1 129.29,47.28 132.59,50.59 132.59,76.49 136.14,80.05 v140.56,80.05 142.24,80.05 142.75,80.56 142.75,81.32 144.02,82.59 147.83,82.59 149.1,81.32 149.1,78.27 150.88,76.49 JP1.8
  Bottom 0.254: J1.XIO-P4 115.11,39.66
  Bottom 0.406: ESD13.C v140.56,80.05
  Bottom 0.61: v115.11,36.67 115.11,39.66 115.11,40.03
GP4  (via drill 0.3, 0.38, 1.1)
  Top 0.254: v114.55,55.92 114.05,55.41 114.05,31.68 v115.15,30.57 | v134.11,56.17 134.11,69.38 136.4,71.67 139.19,71.67 139.45,71.92 139.45,73.86 v143.1,77.51 143.13,77.54 143.13,78.65 143.76,79.29 143.76,81.32 144.27,81.83 147.57,81.83 148.34,81.07 148.34,75.22 149.61,73.95 JP1.9
  Bottom 0.254: 115.14,31.6 v115.15,30.57 | v134.11,56.17 114.81,56.17 v114.55,55.92 | v115.15,30.57 115.15,29.09 R6.2 115.82,28.74 117.09,27.47 117.09,20.61 117.6,20.11 119.79,20.11 PAM1.12 | J1.XIO-P5 115.06,33.58 115.06,33.57 115.15,33.48 v115.15,30.57
  Bottom 0.406: ESD12.C v143.09,77.51 v143.1,77.51
GP5  (via drill 0.3, 1.1)
  Top 0.254: 143.26,74.97 143.76,74.97 144.32,74.39 144.32,72 144.5,71.82 150.37,71.82 150.78,71.41 JP1.10 | 143.26,74.97 v143.1,74.97 | v134.11,54.65 134.87,55.41 134.87,69.13 136.65,70.91 139.7,70.91 140.72,71.92 140.72,72.43 143.26,74.97 | v113.03,54.14 113.03,43.22 v112.52,42.71
  Bottom 0.254: v134.11,54.65 113.54,54.65 v113.03,54.14 | v112.52,42.71 112.52,39.65 J1.XIO-P6
  Bottom 0.406: ESD11.C 143.08,74.96 v143.1,74.97
GP6  (via drill 0.3, 0.38, 1.1)
  Top 0.254: v135.13,54.14 135.64,54.65 135.64,68.87 136.91,70.14 141.22,70.14 141.48,70.4 141.48,70.81 v143.1,72.43 143.1,71.57 143.51,71.16 148.59,71.16 150.88,68.87 JP1.11 | v112.01,52.87 111.51,52.36 111.51,31.36 v112.56,30.31
  Bottom 0.254: 112.56,31.58 v112.56,30.31 | v135.13,54.14 134.87,53.89 114.3,53.89 113.28,52.87 v112.01,52.87 | J1.XIO-P7 112.56,33.61 112.56,33.57
  Bottom 0.406: ESD10.C 143.09,72.44 v143.1,72.43
  Bottom 0.61: 112.56,34.03 112.56,33.57 112.56,31.58
HSYNC  (via drill 0.3)
  Top 0.254: v89.66,66.33 89.92,66.59 89.92,73.95 88.39,75.48 88.39,88.69 86.87,90.21 v86.87,93.26
  Bottom 0.254: X1.32 51.26,72.89 72.14,93.77 86.36,93.77 v86.87,93.26 | v89.66,66.33 89.66,69.14 | 89.66,69.14 89.66,69.67 | J1.LCD-HSYNC 89.66,69.14
I2C-SCL  (via drill 0.3, 0.38, 1.1)
  Top 0.254: v104.9,57.95 v104.9,30.52
  Top 0.61: v143.1,57.19 147.32,57.19 150.88,53.63 JP1.17
  Bottom 0.203: U4.4 101.87,12.87 R16.1 | 101.87,14.15 arc90 v101.85,14.42
  Bottom 0.254: 143.06,57.16 v143.1,57.19 | ESD4.C 141.82,57.86 141.48,58.21 105.16,58.21 v104.9,57.95 | 104.94,33.57 104.94,33.61 J1.TWI2-SCK 104.9,33.58 104.9,31.54 | v104.9,30.52 104.9,31.54 | 101.85,27.83 101.85,28.49 104.9,31.54
  Bottom 0.305: v101.85,14.42 101.85,27.83 | 104.94,33.57 104.94,34.15 | U4.4 101.87,14.15
  Bottom 0.406: ESD4.C 141.97,57.19 v143.1,57.19
I2C-SDA  (via drill 0.3, 1.1)
  Top 0.254: v103.89,58.46 v103.89,43.54
  Top 0.61: v143.1,59.73 147.07,59.73 150.62,56.17 JP1.16
  Bottom 0.203: 103.61,12.86 R17.1
  Bottom 0.254: 143.02,59.73 v143.1,59.73 | ESD5.C 141.83,59.07 141.73,58.97 104.39,58.97 v103.89,58.46 | J1.TWI2-SDA 104.94,39.61 | v103.89,43.54 104.93,42.49 J1.TWI2-SDA | 103.62,27.91 106.17,30.47 106.17,38.38 J1.TWI2-SDA
  Bottom 0.305: U4.6 103.19,9.79 103.61,10.2 103.61,12.86 | R17.1 103.62,27.91
  Bottom 0.406: ESD5.C v143.1,59.73
INL  (via drill 0.3)
  Top 0.254: v129.79,21.12 129.29,20.61 112.78,20.61 111.25,22.14 v111.25,22.39
  Bottom 0.254: C5.2 v129.79,21.12 | v111.25,22.39 111.38,22.52 PAM1.7
INR
  Bottom 0.254: PAM1.10 126.55,22.52 C4.2
KPD_I2C_SCL  (via drill 0.3, 0.38)
  Top 0.254: v11.43,73.7 11.43,80.81 13.97,83.35 67.06,83.35 74.17,90.46 78.99,90.46 80.01,89.45 80.01,55.41 81.03,54.4 v85.34,54.4 | v88.65,54.4 94.74,54.4 100.84,60.49 122.17,60.49 124.21,62.52 124.21,76.66 v122.75,78.11
  Bottom 0.203: 11.46,70.51 11.18,70.22 U5.11
  Bottom 0.254: 122.76,77.85 v122.75,78.11 | 11.46,70.51 11.46,73.67 v11.43,73.7 | v85.34,54.4 v88.65,54.4 | J1.TWI1-SCK 122.76,75.23 122.76,75.46
  Bottom 0.61: 122.76,75.46 122.76,77.85
KPD_I2C_SDA  (via drill 0.3, 0.38)
  Top 0.254: v9.4,70.91 9.4,74.46 10.41,75.48 10.41,81.07 13.46,84.11 66.8,84.11 73.91,91.23 79.25,91.23 80.77,89.7 80.77,56.94 81.79,55.92 v85.34,55.92 | v88.65,55.92 94.74,55.92 100.58,61.76 119.89,61.76 121.67,63.54 121.67,78.27 122.68,79.29 124.12,79.29 v125.31,78.1
  Bottom 0.254: v125.31,78.1 125.31,75.23 J1.TWI1-SDA | U5.9 9.88,70.43 v9.4,70.91 | v85.34,55.92 v88.65,55.92
L+OUT  (via drill 0.3)
  Top 0.406: L+.1 86.87,16.3 107.44,16.3 v107.95,15.79
  Bottom 0.406: v107.95,15.79 108.84,14.9 PAM1.1
L-OUT  (via drill 0.3)
  Top 0.406: L-.1 84.84,15.28 106.43,15.28 107.44,14.26 108.71,14.26 v110.74,16.3
  Bottom 0.406: v110.74,16.3 111.76,17.31 113.64,17.31 PAM1.3
LCD_D3  (via drill 0.3)
  Top 0.254: v113.79,81.07 113.79,67.35 v112.78,66.33
  Bottom 0.254: X1.24 49.93,76.89 70.36,97.32 89.41,97.32 92.2,94.53 92.2,89.19 97.54,83.86 102.11,83.86 102.62,83.35 111.51,83.35 v113.79,81.07 | v112.78,66.33 112.78,69.13 | 112.78,69.13 112.78,69.57 | J1.LCD-D3 112.6,69.13 112.78,69.13
LCD_D4  (via drill 0.3)
  Top 0.254: v112.52,78.02 v112.52,81.07
  Bottom 0.254: X1.25 50.19,76.39 70.61,96.81 89.15,96.81 91.69,94.27 91.69,88.94 97.28,83.35 101.85,83.35 102.36,82.84 110.74,82.84 v112.52,81.07 | v112.52,78.02 112.52,75.21 J1.LCD-D4
LCD_D5  (via drill 0.3)
  Top 0.254: v111.25,81.07 111.25,67.6 v109.98,66.33
  Bottom 0.254: X1.26 50.45,75.89 70.87,96.31 88.9,96.31 91.19,94.02 91.19,88.69 97.03,82.84 101.6,82.84 102.11,82.34 109.98,82.34 v111.25,81.07 | v109.98,66.33 110.24,69.13 | 110.24,69.13 110.24,69.57 | J1.LCD-D5 110.06,69.13 110.24,69.13
LCD_D6  (via drill 0.3)
  Top 0.254: v109.98,81.07 v109.98,78.02
  Bottom 0.254: X1.27 50.71,75.39 71.12,95.8 88.65,95.8 90.68,93.77 90.68,88.43 96.77,82.34 101.35,82.34 101.85,81.83 109.22,81.83 v109.98,81.07 | v109.98,78.02 109.98,75.21 J1.LCD-D6
LCD_D7  (via drill 0.3)
  Top 0.254: v107.44,81.07 107.44,66.59 v107.7,66.33
  Bottom 0.254: X1.28 50.97,74.89 71.37,95.29 88.39,95.29 90.17,93.51 90.17,88.18 96.52,81.83 101.09,81.83 101.85,81.07 v107.44,81.07 | v107.7,66.33 107.7,68.95 | 107.7,68.95 107.7,69.57 | J1.LCD-D7 107.7,68.95
LCD_D10  (via drill 0.3)
  Top 0.254: v108.46,78.02 108.46,83.61 v107.44,84.62
  Bottom 0.254: X1.15 49.85,81.39 68.83,100.37 90.93,100.37 95.25,96.05 95.25,90.72 98.55,87.42 104.65,87.42 v107.44,84.62 | v108.46,78.02 108.46,76.16 J1.LCD-D10
LCD_D11  (via drill 0.3)
  Top 0.254: v106.17,84.62 106.17,67.35 v105.16,66.33
  Bottom 0.254: X1.16 50.12,80.89 69.09,99.86 90.68,99.86 94.74,95.8 94.74,90.46 98.3,86.91 103.89,86.91 v106.17,84.62 | v105.16,66.33 105.16,68.95 | 105.16,68.95 105.16,69.57 | J1.LCD-D11 105.16,68.95
LCD_D12  (via drill 0.3)
  Top 0.254: v104.9,84.62 104.9,78.27 v105.16,78.02
  Bottom 0.254: X1.17 50.38,80.39 69.34,99.35 90.42,99.35 94.23,95.54 94.23,90.21 98.04,86.4 103.12,86.4 v104.9,84.62 | v105.16,78.02 105.16,75.4 J1.LCD-D12
LCD_D13  (via drill 0.3)
  Top 0.254: v103.63,84.62 103.63,67.35 v102.62,66.33
  Bottom 0.254: X1.18 50.64,79.89 69.6,98.85 90.17,98.85 93.73,95.29 93.73,89.96 97.79,85.89 102.36,85.89 v103.63,84.62 | v102.62,66.33 102.62,68.95 | 102.62,68.95 102.62,69.57 | J1.LCD-D13 102.62,68.95
LCD_D14  (via drill 0.3)
  Top 0.254: v102.36,84.62 v102.36,78.02
  Bottom 0.254: X1.19 50.9,79.39 69.85,98.34 89.92,98.34 93.22,95.04 93.22,89.7 97.54,85.38 101.6,85.38 v102.36,84.62 | 102.44,77.18 v102.36,78.02 102.36,75.21 J1.LCD-D14
LCD_D15  (via drill 0.3)
  Top 0.254: v99.82,66.33 99.82,76.49 99.06,77.26 99.06,84.37 v99.31,84.62
  Bottom 0.254: X1.20 51.16,78.89 70.1,97.83 89.66,97.83 92.71,94.78 92.71,89.45 97.79,84.37 99.06,84.37 v99.31,84.62 | v99.82,66.33 99.82,69.14 | 99.82,69.14 99.82,69.67 | J1.LCD-D15 99.82,69.14
LCD_D19  (via drill 0.3)
  Top 0.254: v101.35,90.97 98.3,87.92 98.3,67.35 v97.28,66.33
  Bottom 0.254: X1.8 49.54,84.89 67.56,102.91 92.2,102.91 97.79,97.32 97.79,94.53 v101.35,90.97 | v97.28,66.33 97.28,69.14 | 97.28,69.14 97.28,69.67 | J1.LCD-D19 97.28,69.14
LCD_D20  (via drill 0.3)
  Top 0.254: v100.08,90.97 97.28,88.18 v97.28,78.02
  Bottom 0.254: X1.9 49.81,84.39 67.82,102.4 91.95,102.4 97.28,97.07 97.28,93.77 v100.08,90.97 | v97.28,78.02 97.28,75.21 J1.LCD-D20
LCD_D21  (via drill 0.3)
  Top 0.254: v94.74,66.33 96.01,67.6 96.01,87.92 v98.81,90.97
  Bottom 0.254: X1.10 50.07,83.89 68.07,101.89 91.69,101.89 96.77,96.81 96.77,93 v98.81,90.97 | v94.74,66.33 94.74,69.14 | 94.74,69.14 94.74,69.67 | J1.LCD-D21 94.74,69.14
LCD_D22  (via drill 0.3)
  Top 0.254: v97.54,90.97 94.74,88.18 v94.74,78.02
  Bottom 0.254: X1.11 50.33,83.39 68.33,101.39 91.44,101.39 96.27,96.56 96.27,92.5 97.54,91.23 v97.54,90.97 | v94.74,78.02 94.74,75.21 J1.LCD-D22
LCD_D23  (via drill 0.3)
  Top 0.254: v92.2,66.33 93.22,67.35 93.22,87.92 v96.27,90.97
  Bottom 0.254: X1.12 50.59,82.89 68.58,100.88 91.19,100.88 95.76,96.31 95.76,91.23 96.01,90.97 v96.27,90.97 | v92.2,66.33 92.2,69.14 | 92.2,69.14 92.2,69.67 | J1.LCD-D23 92.2,69.14
LCD_DE  (via drill 0.3, 0.38)
  Top 0.254: v85.85,91.99 85.85,67.57 v87.19,66.23
  Bottom 0.203: v87.19,66.23 87.2,67.51
  Bottom 0.254: X1.34 51.78,71.89 72.64,92.75 85.09,92.75 v85.85,91.99 | J1.LCD-DE 87.12,69.14 87.12,69.13 87.19,69.06 v87.19,66.23
LCD_XL
  Bottom 0.254: X1.39 51.57,69.39 73.41,91.23 84.07,91.23 96.01,79.29 119.38,79.29 120.14,78.53 120.14,75.21 J1.X1
LCD_XR
  Bottom 0.254: X1.37 51.05,70.39 72.9,92.24 84.58,92.24 96.52,80.3 122.43,80.3 123.95,78.78 123.95,72.43 123.7,72.18 121.92,72.18 120.17,70.43 J1.X2
LCD_YD
  Bottom 0.254: X1.38 51.31,69.89 73.15,91.73 84.33,91.73 96.27,79.8 119.63,79.8 121.41,78.02 121.41,72.68 120.9,72.18 118.36,72.18 117.86,71.67 117.86,69.4 J1.Y2
LCD_YU
  Bottom 0.254: X1.40 51.83,68.89 73.66,90.72 83.82,90.72 95.76,78.78 117.35,78.78 117.86,78.27 117.86,75.4 J1.Y1
N$1  (via drill 1.1)
  other vias: 50.55,50.59
N$48
  Bottom 0.203: 100.87,11.62 C17.1
  Bottom 0.279: U4.2 100.87,11.62
N$50
  Bottom 0.254: U5.4 11.18,56.53 10.87,56.2 9.22,56.2 8.87,56.56 8.87,57.24
  Bottom 0.305: 8.87,57.26 LED1.GREEN 8.87,57.24
N$51
  Bottom 0.254: 10.53,57.45 LED1.RED
  Bottom 0.305: 10.5,57.42 LED1.RED
  Bottom 0.356: U5.5 10.53,57.45
N$53
  Bottom 0.254: U5.10 10.49,69.62 R8.2
  Bottom 0.305: 10.5,71.14 R8.2
N$60  (via drill 0.3)
  Top 0.254: v124.46,99.35 125.98,99.35 v126.49,98.85
  Bottom 0.254: U$27.4 124.16,99.05 v124.46,99.35 | v126.49,98.85 126.86,99.21 IC1.4
N$61
  Bottom 0.406: C1.1 112.27,26.2 111.51,25.44 111.51,24.42 112.01,23.92 113.64,23.92 PAM1.8
N$62
  Bottom 0.254: LI.1 132.01,27.54 R1.1 C5.1 129.98,25.19 LO.1
N$63
  Bottom 0.254: RO.1 126.68,25.44 C4.1 R5.1 126.56,27.73 RI.1
N$64
  Bottom 0.61: PAD1.1 28.79,5.37 D3.A
N$65
  Bottom 0.61: 31.75,18.96 33.12,18.96 L1.P$2 34.29,20.13 34.29,24.42 33.78,24.93 C21.2 | 31.75,18.96 U$12.3 | D1.C 31.75,14.43 31.75,18.96
N$66
  Bottom 0.61: C21.1 29.29,24.69 U$12.1
N$67
  Bottom 0.61: C22.2 R2.1
N$68
  Bottom 0.61: U$12.6 21.53,18.96 C22.1
N$69
  Bottom 0.254: R3.1 R9.2 42.42,24.68 40.13,26.96 26.67,26.96 25.65,25.95 25.65,18.07 25.27,17.69 U$12.5
N$70  (via drill 0.3)
  Top 0.254: v136.4,4.61 136.4,6.39 v141.22,11.22
  Bottom 0.254: U$13.13 139.41,10.74 139.7,10.45 141.6,10.45 C31.2 142.36,11.22 v141.22,11.22 | U$13.21 136.21,4.8 v136.4,4.61
N$71
  Bottom 0.254: U$13.28 131.73,8.07 132.08,8.42 142.62,8.42 | U$13.12 138.77,9.1 138.94,8.93 142.75,8.93 | 142.75,8.93 143,8.93 | C30.2 142.62,8.42 | 142.62,8.42 142.62,8.8 142.75,8.93
N$72
  Bottom 0.254: U$13.14 140.37,11.88 140.97,12.49 146.81,12.49 147.07,12.23 147.07,6.71 R10.2
N$73  (via drill 0.3)
  Top 0.254: v148.59,15.03 147.32,13.76 v147.32,4.1
  Bottom 0.254: U$13.17 138.77,4.02 139.45,3.34 146.3,3.34 v147.32,4.1 | v148.59,15.03 148.84,15.28 R13.2
N$74  (via drill 0.3)
  Top 0.254: v150.88,15.03 148.34,12.49 148.34,3.6 v147.57,2.83
  Bottom 0.254: R11.2 v150.88,15.03 | v147.57,2.83 138.43,2.83 137.49,3.77 U$13.19
N$75
  Bottom 0.254: Q1.2 132.37,13.72 U$13.2
  Bottom 0.406: C33.1 126.93,19.16 Q1.2
N$76
  Bottom 0.254: U$13.3 133.01,13.67 136.4,17.06 Q1.1
  Bottom 0.406: C34.1 139,17.38 Q1.1
N$77
  Bottom 0.406: R19.1 140.65,26.86 LED6.C
N$78
  Bottom 0.406: R15.1 142.24,33.06 142.75,32.55 142.75,22.65 142.49,22.39 140.75,22.39 LED4.C LED5.A
N$79
  Bottom 0.406: LED3.C LED2.A 141.48,25.19 141.99,25.69 141.99,30.77 141.73,31.03 R14.1
N$80  (via drill 0.3)
  Top 0.254: v135.38,4.1 135.38,6.39 140.72,11.72 140.72,19.34 139.19,20.87 v137.16,20.87
  Bottom 0.254: U$13.22 135.59,4.31 v135.38,4.1 | v137.16,20.87 138.14,20.87 LED5.C
  Bottom 0.406: LED2.C LED3.A 138.4,23.44 138.43,23.41 138.43,22.17 LED4.A LED5.C | LED2.C LED6.A 138.43,26.71 138.43,25.22 LED2.C
N$81  (via drill 0.3)
  Top 0.254: v136.65,28.74 136.65,23.66 135.13,22.14 135.13,19.6 136.4,18.33 138.43,18.33 139.7,17.06 139.7,12.74 133.35,6.39 v133.35,4.61
  Bottom 0.254: R14.2 138.43,31.03 137.41,30.01 137.41,29.5 v136.65,28.74 | v133.35,4.61 134.29,5.55 U$13.24
N$82  (via drill 0.3)
  Top 0.254: v134.37,3.85 134.37,6.39 140.21,12.23 140.21,17.31 138.68,18.84 137.16,18.84 136.4,19.6 136.4,21.38 136.91,21.88 139.95,21.88 140.21,22.14 140.21,34.58 v139.95,34.84
  Bottom 0.254: U$13.23 134.93,4.92 134.37,4.36 v134.37,3.85 | v139.95,34.84 138.94,34.84 138.68,34.58 138.68,33.13 R15.2
N$555
  Bottom 0.305: U5.3 11.8,64.74 11.15,65.39 9.04,65.39 7.98,64.33 7.98,53.99 8.89,53.08 8.89,52.06 LED1.BLUE
PWM  (via drill 0.3)
  Top 0.254: v115.06,66.33 115.06,101.64 v112.52,104.18
  Bottom 0.254: 115.06,69.67 115.06,69.14 | 115.06,69.14 v115.06,66.33 | v112.52,104.18 112.52,104.69 113.79,105.96 126.49,105.96 128.27,104.18 128.27,100.12 128.52,99.86 IC1.2 | J1.PWM0 115.06,69.14
PWR_LGT  (via drill 0.38)
  other vias: 15.91,80.91 14.92,80.91
  pour Bottom (isolate 0.4): 21.18,104.69 16.92,100.45 16.92,87.29 16.4,86.71 14.06,84.37 14.06,80.56 14.57,80.05 15.84,80.05 16.35,80.56 16.35,83.86 17.87,85.44 17.87,97.88 23.46,103.55
R+OUT  (via drill 0.3)
  Top 0.406: R+.1 83.06,83.61 84.07,82.59 84.07,61.51 87.12,58.46 87.12,53.13 84.07,50.08 84.07,24.68 90.17,18.58 119.38,18.58 v122.94,15.03
  Bottom 0.406: v122.94,15.03 122.81,14.9 PAM1.16
R-OUT  (via drill 0.3)
  Top 0.406: R-.1 81.53,86.4 81.53,82.84 83.06,81.32 83.06,61.25 86.36,57.95 86.36,53.63 83.06,50.33 83.06,24.17 89.92,17.31 v118.11,17.31
  Bottom 0.406: v118.11,17.31 118.24,17.44 PAM1.14
SA0
  Bottom 0.203: U4.7 R18.1
SDIO_CARD  (via drill 0.3)
  Top 0.406: v95,22.65 104.39,22.65 v104.9,23.15
  Bottom 0.254: J1.AP-EINT3 107.49,33.62 107.7,33.82 107.7,30.52 104.9,27.73 v104.9,23.15
  Bottom 0.406: SDIO.9 93.72,21.37 v95,22.65 | 107.7,33.82 107.7,34.01
SDIO_CLK
  Bottom 0.254: SDIO.5 89.32,24.34 92.2,27.22 92.2,33.82 | 92.2,33.82 92.2,34.11 | J1.CSID5 92.23,33.79 92.2,33.82
SDIO_CMD
  Bottom 0.254: SDIO.3 87.12,23.92 90.93,27.73 90.93,38.55 92,39.62 J1.CISD4
SDIO_DAT0
  Bottom 0.254: SDIO.7 91.52,24 96.27,28.74 96.27,38.8 97.08,39.62 J1.CSID0
SDIO_DAT1
  Bottom 0.254: SDIO.8 92.62,23.57 97.28,28.23 97.28,33.57 | 97.28,33.57 97.28,34.11 | J1.CSID1 97.31,33.6 97.28,33.57
SDIO_DAT2  (via drill 0.3)
  Top 0.254: v88.65,29.5 93.22,29.5 94.49,30.77 94.49,36.62 v94.74,36.87
  Bottom 0.254: SDIO.1 84.92,25.78 v88.65,29.5 | v94.74,36.87 94.74,37.63 | 94.74,37.63 94.74,39.82 | J1.CSID2 94.77,37.66 94.74,37.63
SDIO_DAT3  (via drill 0.3)
  Top 0.254: v89.66,27.98 93.47,27.98 v94.23,28.74
  Bottom 0.254: SDIO.2 86.02,24.34 v89.66,27.98 | v94.23,28.74 94.82,29.33 94.82,33.57 J1.CSID3
SPI-CLK  (via drill 0.3, 1.1)
  Top 0.254: v136.65,57.19 136.4,57.44 136.4,68.62 136.91,69.13 142.33,69.13 v143.1,69.89
  Top 0.61: v143.1,69.89 147.57,69.89 151.13,66.33 JP1.12
  Bottom 0.254: ESD9.C 141.82,69.73 | v136.65,57.19 103.12,57.19 102.62,56.68 102.62,42.71 103.63,41.7 103.63,34.85 J1.CSICK
  Bottom 0.406: ESD9.C 143.07,69.86 arc90 v143.1,69.89
SPI-MISO  (via drill 1.1)
  Top 0.61: v143.1,64.81 147.57,64.81 151.13,61.25 JP1.14
  Bottom 0.254: ESD7.C 141.82,63.63 141.73,63.54 139.7,63.54 136.65,60.49 102.87,60.49 100.58,58.21 100.58,42.2 101.35,41.44 101.35,35.11 J1.CSIVSYNC
  Bottom 0.406: ESD7.C v143.1,64.81
SPI-MOSI  (via drill 1.1)
  Top 0.61: v143.1,67.35 147.83,67.35 151.38,63.79 JP1.13
  Bottom 0.254: 142.98,67.24 v143.1,67.35 | ESD8.C 141.82,66.17 141.73,66.08 140.46,66.08 135.64,61.25 102.36,61.25 99.86,58.76 99.86,39.66 J1.CSIHYSYNC
  Bottom 0.406: ESD8.C v143.1,67.35
  Bottom 0.61: 99.86,37.18 99.86,39.66 99.86,40.03
SPI-SEL  (via drill 1.1)
  Top 0.61: v143.1,62.27 147.32,62.27 150.88,58.71 JP1.15
  Bottom 0.254: ESD6.C 141.83,61.61 141.48,61.25 138.43,61.25 136.91,59.73 103.89,59.73 101.85,57.7 101.85,42.2 102.36,41.7 102.36,39.65 J1.CSPICK
  Bottom 0.406: ESD6.C 141.97,62.27 v143.1,62.27
UART_RX  (via drill 0.38, 1.1)
  Top 0.406: v130.29,43.07 130.29,46.74 138.2,54.65 v143.1,54.65
  Top 0.61: v143.1,54.65 147.32,54.65 150.88,51.09 JP1.18
  Bottom 0.254: J1.UART1-RX 130.29,39.66 130.29,40.04
  Bottom 0.305: 130.29,41.34 130.29,40.04
  Bottom 0.406: ESD3.C v143.1,54.65
  Bottom 0.61: v130.29,43.07 130.29,41.34
UART_TX  (via drill 0.38, 1.1)
  Top 0.406: 143.07,52.09 138.13,52.09 132.9,46.85 132.9,43.06 v132.88,43.04
  Top 0.61: v143.1,52.11 147.57,52.11 151.13,48.55 JP1.19 | 143.23,52.09 v143.1,52.11 | 143.07,52.09 v143.1,52.11
  Bottom 0.254: 143.07,52.09 v143.1,52.11 | J1.UART1-TX v132.88,43.04
  Bottom 0.305: 132.93,43.03 v132.88,43.04
  Bottom 0.406: ESD2.C 143.07,52.08 v143.1,52.11
V_UP  (1 unrouted)
VBAT_EXT  (via drill 0.3, 0.38)  (2 unrouted)
  Top 0.406: v138.3,86.55 135.99,86.55 v132.59,89.96 136.4,93.77 143.26,93.77 144.78,95.29 147.07,95.29 155.7,86.65 JP1.4
  Top 0.813: v127.81,72.05 127,72.85 v127,86.65
  Bottom 0.406: v127.81,72.05 | ESD17.A 137.47,86.56 v138.3,86.56 v138.3,86.55 | v127,86.65 128.02,86.65 128.78,87.42 128.78,89.96 129.03,90.21 132.33,90.21 v132.59,89.96
  Bottom 0.61: U$27.6 121.92,97.97 121.92,94.53
  Bottom 0.813: L2.P$2 117.58,94.27 117.86,94.27 118.11,94.53 121.92,94.53 121.92,93 123.7,91.23 C14.1 125.29,90.27 C6.1 125.22,88.87 125.22,87.16 125.73,86.65 v127,86.65
  Bottom 1.27: J3.1 70.02,12.67 71.32,12.67 72.44,13.78 72.44,22.81 82.19,32.54 82.19,63.18 83.57,64.56 126.23,64.56 127.84,66.17 | 127.81,69.78 v127.81,72.05
VCC  (via drill 0.3)  (9 unrouted)
  Top 0.254: v44.2,20.36 v44.2,10.45
  Top 0.406: v149.61,26.2 149.61,28.23 v148.84,29 | X4.VBUS 159.29,28.96 153.92,34.33 C28.2 151.77,32.94 v151.38,32.55 | C29.2 157.61,18.17 X5.VBUS
  Bottom 0.254: R9.1 44.13,20.43 v44.2,20.36 | v44.2,10.45 44.2,9.52
  Bottom 0.406: X2.VBUS 111.76,4.61 110.74,3.6 108.08,3.6 C26.2 | X3.VBUS 119.89,4.61 120.9,3.6 124.71,3.6 125.48,4.36 125.48,5.25 C27.2 127,6.77 127,6.9 128.27,8.17 128.46,8.17 | 128.46,8.17 129.79,8.17 130.56,7.41 130.56,5.37 130.81,5.12 132.59,5.12 133.01,5.54 U$13.26 U$13.25 | 128.46,8.17 C32.2 | VD1.5 v149.61,26.2 | v151.38,32.55 148.84,30.01 v148.84,29
  Bottom 0.813: D4.C 44.2,9.52 49.95,9.52 54.36,5.12 71.12,5.12
VCC3V3  (via drill 0.3, 0.38, 0.6)  (2 unrouted)
  Top 0.254: 129.72,97.75 129.72,99.43 v127,102.15 | v122.76,52.92 122.99,52.92 129.29,59.22 129.29,77.7 v129.71,78.12
  Top 0.406: v129.1,78.93 129.08,78.91 | v109.47,22.39 109.22,22.65 109.22,24.68 109.47,24.93 120.14,24.93 122.43,27.22 | 105.92,13.25 v99.34,13.25 98.81,13.25 98.55,12.99 | 98.55,12.99 98.55,7.33 v98.58,7.3 | v122.43,21.38 122.43,27.22 | 122.43,27.22 122.43,34.08 v125.22,36.87 | 98.55,12.99 88.9,12.99 v88.39,13.5 | v131.32,88.94 131.32,96.31 v131.83,96.81 | v14.53,71.17 14.59,71.17 14.62,71.19 14.55,71.19 v14.53,71.17
  Top 0.61: 14.03,50.68 14.01,50.7 v14.02,50.7 v14.02,50.71
  Top 1.016: v129.72,78.13 v129.71,78.12 | 129.51,79.34 129.69,79.34
  Top 1.27: 77.27,106.97 v77.31,106.97 v78.86,106.97 133.35,106.97 135.13,105.2 135.13,103.16 129.72,97.75 v129.72,78.13 | 129.08,78.91 129.51,79.34
  Bottom 0.203: 100.37,12.87 R16.2 100.37,13.05 | 100.09,8.78 U4.14 | R18.2 105.89,9.29 v105.89,13.25 | 98.58,8.76 C19.1
  Bottom 0.254: U5.13 12.45,69.61 C12.2 | X1.4 50.78,86.89 67.31,103.42 78.23,103.42 78.74,103.93 78.74,106.86 v78.86,106.97 | IC1.5 127,100.93 v127,102.15 | R12.2 121.14,81.56 122.43,82.84 129.16,82.84 129.67,83.35 | 129.41,87.16 129.67,87.42 | PAM1.5 113.64,19.85 111.76,19.85 111.51,19.6 111.51,18.9 C3.2 | PAM1.6 112.58,21.25 C20.1 C3.2 | PAM1.13 122.62,18.71 C2.2 | C3.2 113.64,18.58 PAM1.4 | 125.3,39.9 125.3,50.38 v122.76,52.92 | J1.VCC3V3@1 125.3,39.66
  Bottom 0.279: U4.1 100.37,13.05 | 100.09,8.78 C19.1
  Bottom 0.305: U5.12 U5.13 | C12.2 12.52,71.16
  Bottom 0.406: 12.52,71.16 v14.52,71.16 v14.53,71.17 | 9.46,77.25 11,78.78 13.34,78.78 | v14.7,77.59 14.68,77.59 14.61,77.51 | 125.3,39.9 125.3,39.66 125.3,37.71 v125.22,36.87 | C20.1 109.47,22.33 v109.47,22.39 106.68,22.39 105.41,21.12 105.41,14.01 105.89,13.53 v105.89,13.25 104.65,13.25 | PAM1.13 122.56,18.71 122.68,18.84 122.68,21.12 v122.43,21.38 | SDIO.4 88.22,13.67 v88.39,13.5 | 129.67,83.35 129.67,87.29 v131.32,88.94 | v131.83,96.81 132.08,97.07 Q3.3
  Bottom 0.61: C11.2 LED1.VIN | C11.2 | C11.2 13.06,52.06 | 13.06,52.06 14,53 14,54.65 | 13.06,52.06 14.01,51.11 14.01,50.7 v14.02,50.7 v14.02,50.71 | v105.89,13.25 R17.2 | R16.2 v99.34,13.25 | v98.58,7.3 98.58,8.76
  Bottom 0.635: C19.1 C18.1
  Bottom 0.813: v129.71,78.12 130.3,78.71 130.3,82.34 129.67,82.97 129.67,83.35 | 137.03,97.07 Q3.3
  Bottom 1.27: 14.61,77.51 13.34,78.78 13.34,81.32 11.43,83.23 7.62,83.23 4.45,86.4 4.45,93.39 18.03,106.97 v77.31,106.97 78.99,106.97
  other vias: 14.62,30.75
  pour Top (isolate 0.4, rank 2): 16,42.2 16,79.29 14.22,79.29 13.11,78.12 13.11,58.99 arc-45 14.89,55.01 14.9,54.75 arc-45 13.14,50.66 13.13,41.85 15.49,39.41 15.49,35.09 14.73,34.33 10.41,34.33 9.14,33.06 9.14,31.03 9.91,30.27 15.75,30.27 17.78,32.3 17.75,40.68
  pour Bottom (isolate 0.305): 128.92,72.79 129.28,72.43 130.85,72.43 131.06,72.51 131.13,72.68 131.13,80 130.6,80.61 127.91,80.61 127.91,78.47 128.92,78.02
VCC5V  (via drill 0.3)
  Top 0.61: v138.18,56.94 v138.18,67.1
  Bottom 0.406: 137.41,72.18 134.37,72.18 132.87,73.67 J1.VCC-5V@1
  Bottom 0.61: J1.VCC-5V@2 136.7,33.62 136.91,33.82 136.91,55.67 v138.18,56.94 | v138.18,67.1 138.18,71.41 137.41,72.18
  Bottom 0.813: C10.1 132.46,83.23 132.46,87.67 136.27,91.48 Q4.3
  pour Bottom (isolate 0.305): 136.33,37.63 134.05,37.63 134.05,29.65 137.34,29.65 137.34,84.44 132.66,84.44 131.77,84.47 131.77,73.04 132.12,72.68 133.6,72.68 134.31,73.47 134.31,78.6 134.76,78.96 135.72,78.91 136.36,78.15
VIN
  Bottom 0.61: U$12.2 27.56,20.23 26.92,19.6 26.92,15.4 C25.2 26.67,14.9 D3.C
VREG_OUTPUT1
  Bottom 0.61: U$27.1 122.24,101.57 122.17,101.64 | 118.87,102.4 121.41,102.4 122.17,101.64 | 122.17,101.64 122.17,100.37 120.14,98.34 118.62,98.34 118.25,98.71
  Bottom 1.016: L2.P$1 118.25,98.71 118.64,99.09 D2.A
VSYNC  (via drill 0.3)
  Top 0.254: v89.66,78.02 89.66,88.94 v87.63,90.97
  Bottom 0.254: X1.33 51.52,72.39 72.39,93.26 85.85,93.26 87.63,91.48 v87.63,90.97 | v89.66,78.02 89.66,75.21 J1.LCD-VSYNC

## Text on the board
bPlace: PWR_LGT | VCC5V
bNames: 3.3V | 5V